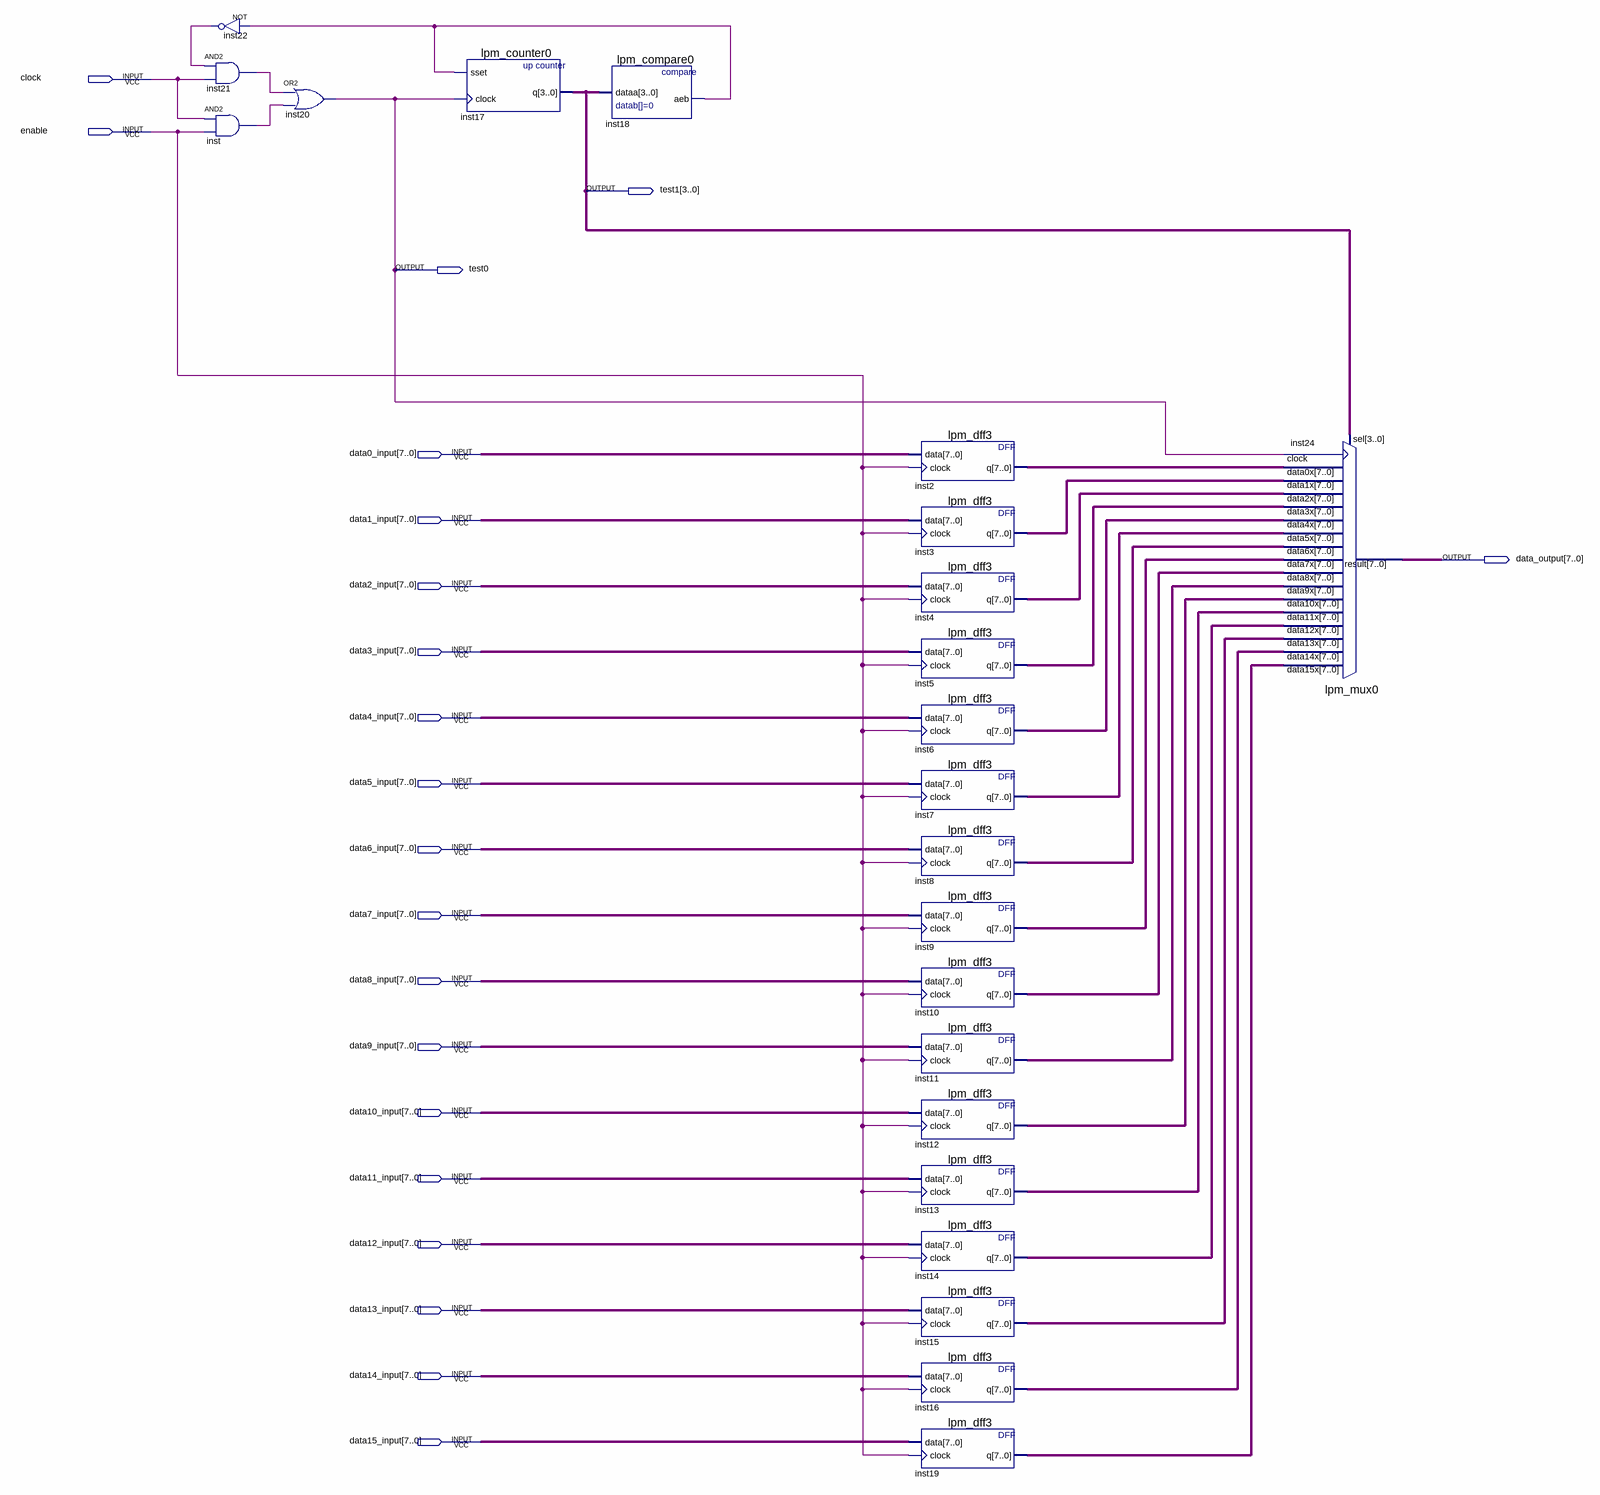
[diagram p0: schematic sheet]
// Quartus schematic to_consistently.bdf as structural Verilog: 23 symbols, 21 pins
module to_consistently (
  input  clock,
  input  enable,
  input  [7:0] data0_input,
  input  [7:0] data1_input,
  input  [7:0] data2_input,
  input  [7:0] data3_input,
  input  [7:0] data4_input,
  input  [7:0] data5_input,
  input  [7:0] data6_input,
  input  [7:0] data7_input,
  input  [7:0] data8_input,
  input  [7:0] data9_input,
  input  [7:0] data10_input,
  input  [7:0] data11_input,
  input  [7:0] data12_input,
  input  [7:0] data13_input,
  input  [7:0] data14_input,
  input  [7:0] data15_input,
  output [3:0] test1,
  output test0,
  output [7:0] data_output
);

  wire inst18_aeb, inst21_out, inst22_out, inst_out;
  wire [7:0] inst2_q, inst3_q, inst4_q, inst5_q, inst6_q, inst7_q, inst8_q, inst9_q, inst10_q, inst11_q,
       inst12_q, inst13_q, inst14_q, inst15_q, inst16_q, inst19_q;

  not inst22 (inst22_out, inst18_aeb);
  and inst21 (inst21_out, inst22_out, clock);
  and inst (inst_out, clock, enable);
  or inst20 (test0, inst21_out, inst_out);
  lpm_counter0 inst17 (.sset(inst18_aeb), .clock(test0), .q(test1));
  lpm_compare0 inst18 (.dataa(test1), .aeb(inst18_aeb));
  lpm_dff3 inst2 (.data(data0_input), .clock(enable), .q(inst2_q));
  lpm_dff3 inst3 (.data(data1_input), .clock(enable), .q(inst3_q));
  lpm_dff3 inst4 (.data(data2_input), .clock(enable), .q(inst4_q));
  lpm_dff3 inst5 (.data(data3_input), .clock(enable), .q(inst5_q));
  lpm_dff3 inst6 (.data(data4_input), .clock(enable), .q(inst6_q));
  lpm_dff3 inst7 (.data(data5_input), .clock(enable), .q(inst7_q));
  lpm_dff3 inst8 (.data(data6_input), .clock(enable), .q(inst8_q));
  lpm_dff3 inst9 (.data(data7_input), .clock(enable), .q(inst9_q));
  lpm_dff3 inst10 (.data(data8_input), .clock(enable), .q(inst10_q));
  lpm_dff3 inst11 (.data(data9_input), .clock(enable), .q(inst11_q));
  lpm_dff3 inst12 (.data(data10_input), .clock(enable), .q(inst12_q));
  lpm_dff3 inst13 (.data(data11_input), .clock(enable), .q(inst13_q));
  lpm_dff3 inst14 (.data(data12_input), .clock(enable), .q(inst14_q));
  lpm_dff3 inst15 (.data(data13_input), .clock(enable), .q(inst15_q));
  lpm_dff3 inst16 (.data(data14_input), .clock(enable), .q(inst16_q));
  lpm_dff3 inst19 (.data(data15_input), .clock(enable), .q(inst19_q));
  lpm_mux0 inst24 (
    .data15x(inst19_q), .data14x(inst16_q), .data13x(inst15_q), .data12x(inst14_q), .data11x(inst13_q),
    .data10x(inst12_q), .data9x(inst11_q), .data8x(inst10_q), .data7x(inst9_q), .data6x(inst8_q),
    .data5x(inst7_q), .data4x(inst6_q), .data3x(inst5_q), .data2x(inst4_q), .data1x(inst3_q),
    .data0x(inst2_q), .clock(test0), .sel(test1), .result(data_output));
endmodule
